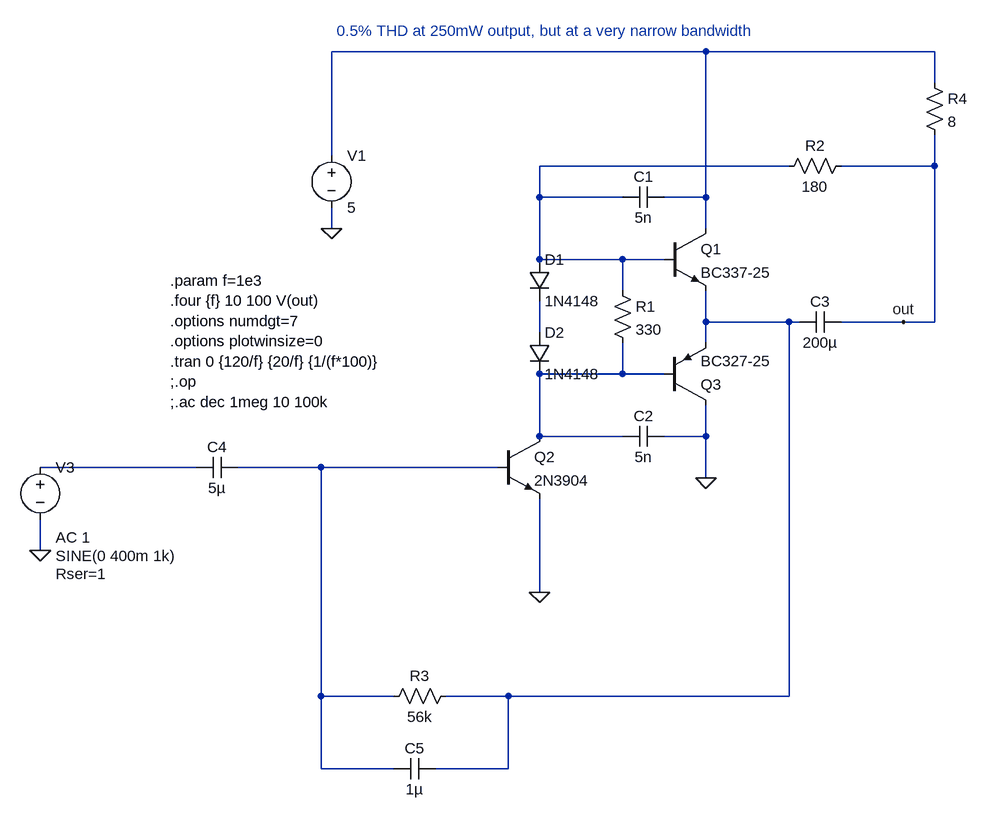
[diagram p0: schematic ITT_Pony13.asc]
ITT_Pony13.asc, the LTspice schematic file:
Version 4
SHEET 1 880 912
WIRE 384 -240 -192 -240
WIRE 736 -240 384 -240
WIRE 736 -192 736 -240
WIRE -192 -80 -192 -240
WIRE 512 -64 128 -64
WIRE 736 -64 736 -112
WIRE 736 -64 592 -64
WIRE 128 -16 128 -64
WIRE 256 -16 128 -16
WIRE 384 -16 384 -240
WIRE 384 -16 320 -16
WIRE -192 32 -192 0
WIRE 384 32 384 -16
WIRE 128 80 128 -16
WIRE 256 80 128 80
WIRE 320 80 256 80
WIRE 256 128 256 80
WIRE 384 176 384 128
WIRE 512 176 384 176
WIRE 528 176 512 176
WIRE 688 176 592 176
WIRE 736 176 736 -64
WIRE 736 176 688 176
WIRE 128 192 128 144
WIRE 384 208 384 176
WIRE 256 256 256 208
WIRE 256 256 128 256
WIRE 320 256 256 256
WIRE 128 352 128 256
WIRE 256 352 128 352
WIRE 384 352 384 304
WIRE 384 352 320 352
WIRE -400 400 -640 400
WIRE -208 400 -336 400
WIRE 64 400 -208 400
WIRE 384 416 384 352
WIRE -640 528 -640 480
WIRE 128 592 128 448
WIRE -208 752 -208 400
WIRE -96 752 -208 752
WIRE 80 752 -16 752
WIRE 512 752 512 176
WIRE 512 752 80 752
WIRE -208 864 -208 752
WIRE -96 864 -208 864
WIRE 80 864 80 752
WIRE 80 864 -32 864
FLAG -192 32 0
FLAG -640 528 0
FLAG 128 592 0
FLAG 384 416 0
FLAG 688 176 out
DATAFLAG 464 176 ""
DATAFLAG -208 400 ""
SYMBOL npn 320 32 R0
SYMATTR InstName Q1
SYMATTR Value BC337-25
SYMBOL npn 64 352 R0
SYMATTR InstName Q2
SYMATTR Value 2N3904
SYMBOL pnp 320 304 M180
SYMATTR InstName Q3
SYMATTR Value BC327-25
SYMBOL res 240 112 R0
SYMATTR InstName R1
SYMATTR Value 330
SYMBOL diode 112 80 R0
SYMATTR InstName D1
SYMATTR Value 1N4148
SYMBOL diode 112 192 R0
SYMATTR InstName D2
SYMATTR Value 1N4148
SYMBOL cap 320 -32 R90
WINDOW 0 0 32 VBottom 2
WINDOW 3 32 32 VTop 2
SYMATTR InstName C1
SYMATTR Value 5n
SYMBOL cap 320 336 R90
WINDOW 0 0 32 VBottom 2
WINDOW 3 32 32 VTop 2
SYMATTR InstName C2
SYMATTR Value 5n
SYMBOL cap 592 160 R90
WINDOW 0 0 32 VBottom 2
WINDOW 3 32 32 VTop 2
SYMATTR InstName C3
SYMATTR Value 200µ
SYMBOL res 608 -80 R90
WINDOW 0 0 56 VBottom 2
WINDOW 3 32 56 VTop 2
SYMATTR InstName R2
SYMATTR Value 180
SYMBOL voltage -192 -96 R0
SYMATTR InstName V1
SYMATTR Value 5
SYMBOL cap -336 384 R90
WINDOW 0 0 32 VBottom 2
WINDOW 3 32 32 VTop 2
SYMATTR InstName C4
SYMATTR Value 5µ
SYMBOL res 0 736 R90
WINDOW 0 0 56 VBottom 2
WINDOW 3 32 56 VTop 2
SYMATTR InstName R3
SYMATTR Value 56k
SYMBOL res 720 -208 R0
SYMATTR InstName R4
SYMATTR Value 8
SYMBOL voltage -640 384 R0
WINDOW 3 24 152 Left 2
WINDOW 123 24 124 Left 2
WINDOW 39 24 180 Left 2
SYMATTR Value SINE(0 400m 1k)
SYMATTR Value2 AC 1
SYMATTR SpiceLine Rser=1
SYMATTR InstName V3
SYMBOL cap -32 848 R90
WINDOW 0 0 32 VBottom 2
WINDOW 3 32 32 VTop 2
SYMATTR InstName C5
SYMATTR Value 1µ
TEXT -440 112 Left 2 !.param f=1e3\n.four {f} 10 100 V(out)\n.options numdgt=7\n.options plotwinsize=0\n.tran 0 {120/f} {20/f} {1/(f*100)}\n;.op\n;.ac dec 1meg 10 100k
TEXT -184 -272 Left 2 ;0.5% THD at 250mW output, but at a very narrow bandwidth

The netlist it stands for:
* ITT_Pony13.asc
Q1 N001 N002 N003 0 BC337-25
Q2 N005 N007 0 0 2N3904
Q3 0 N005 N003 0 BC327-25
R1 N002 N005 330
D1 N002 N004 1N4148
D2 N004 N005 1N4148
C1 N001 N002 5n
C2 0 N005 5n
C3 out N003 200µ
R2 out N002 180
V1 N001 0 5
C4 N007 N006 5µ
R3 N003 N007 56k
R4 N001 out 8
V3 N006 0 SINE(0 400m 1k) AC 1 Rser=1
C5 N003 N007 1µ
.model D D
.lib standard.dio
.model NPN NPN
.model PNP PNP
.lib standard.bjt
.param f=1e3
.four {f} 10 100 V(out)
.options numdgt=7
.options plotwinsize=0
.tran 0 {120/f} {20/f} {1/(f*100)}
;.op
;.ac dec 1meg 10 100k
* 0.5% THD at 250mW output, but at a very narrow bandwidth
.backanno
.end